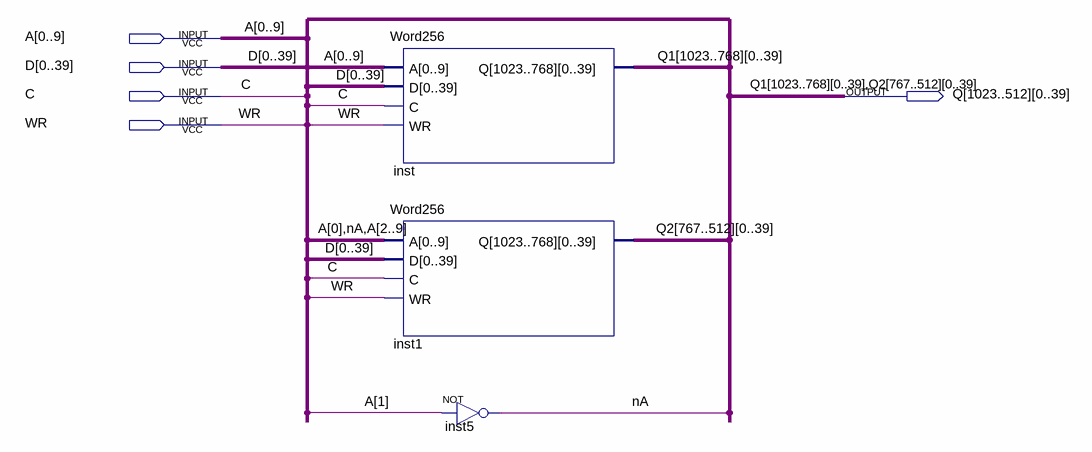
[diagram p0: schematic sheet]
// Quartus schematic Word512.bdf as structural Verilog: 3 symbols, 5 pins
module Word512 (
  input  [0:9] A,
  input  [0:39] D,
  input  C,
  input  WR,
  output [39:0] Q_1023,
  output [39:0] Q_1022,
  output [39:0] Q_1021,
  output [39:0] Q_1020,
  output [39:0] Q_1019,
  output [39:0] Q_1018,
  output [39:0] Q_1017,
  output [39:0] Q_1016,
  output [39:0] Q_1015,
  output [39:0] Q_1014,
  output [39:0] Q_1013,
  output [39:0] Q_1012,
  output [39:0] Q_1011,
  output [39:0] Q_1010,
  output [39:0] Q_1009,
  output [39:0] Q_1008,
  output [39:0] Q_1007,
  output [39:0] Q_1006,
  output [39:0] Q_1005,
  output [39:0] Q_1004,
  output [39:0] Q_1003,
  output [39:0] Q_1002,
  output [39:0] Q_1001,
  output [39:0] Q_1000,
  output [39:0] Q_999,
  output [39:0] Q_998,
  output [39:0] Q_997,
  output [39:0] Q_996,
  output [39:0] Q_995,
  output [39:0] Q_994,
  output [39:0] Q_993,
  output [39:0] Q_992,
  output [39:0] Q_991,
  output [39:0] Q_990,
  output [39:0] Q_989,
  output [39:0] Q_988,
  output [39:0] Q_987,
  output [39:0] Q_986,
  output [39:0] Q_985,
  output [39:0] Q_984,
  output [39:0] Q_983,
  output [39:0] Q_982,
  output [39:0] Q_981,
  output [39:0] Q_980,
  output [39:0] Q_979,
  output [39:0] Q_978,
  output [39:0] Q_977,
  output [39:0] Q_976,
  output [39:0] Q_975,
  output [39:0] Q_974,
  output [39:0] Q_973,
  output [39:0] Q_972,
  output [39:0] Q_971,
  output [39:0] Q_970,
  output [39:0] Q_969,
  output [39:0] Q_968,
  output [39:0] Q_967,
  output [39:0] Q_966,
  output [39:0] Q_965,
  output [39:0] Q_964,
  output [39:0] Q_963,
  output [39:0] Q_962,
  output [39:0] Q_961,
  output [39:0] Q_960,
  output [39:0] Q_959,
  output [39:0] Q_958,
  output [39:0] Q_957,
  output [39:0] Q_956,
  output [39:0] Q_955,
  output [39:0] Q_954,
  output [39:0] Q_953,
  output [39:0] Q_952,
  output [39:0] Q_951,
  output [39:0] Q_950,
  output [39:0] Q_949,
  output [39:0] Q_948,
  output [39:0] Q_947,
  output [39:0] Q_946,
  output [39:0] Q_945,
  output [39:0] Q_944,
  output [39:0] Q_943,
  output [39:0] Q_942,
  output [39:0] Q_941,
  output [39:0] Q_940,
  output [39:0] Q_939,
  output [39:0] Q_938,
  output [39:0] Q_937,
  output [39:0] Q_936,
  output [39:0] Q_935,
  output [39:0] Q_934,
  output [39:0] Q_933,
  output [39:0] Q_932,
  output [39:0] Q_931,
  output [39:0] Q_930,
  output [39:0] Q_929,
  output [39:0] Q_928,
  output [39:0] Q_927,
  output [39:0] Q_926,
  output [39:0] Q_925,
  output [39:0] Q_924,
  output [39:0] Q_923,
  output [39:0] Q_922,
  output [39:0] Q_921,
  output [39:0] Q_920,
  output [39:0] Q_919,
  output [39:0] Q_918,
  output [39:0] Q_917,
  output [39:0] Q_916,
  output [39:0] Q_915,
  output [39:0] Q_914,
  output [39:0] Q_913,
  output [39:0] Q_912,
  output [39:0] Q_911,
  output [39:0] Q_910,
  output [39:0] Q_909,
  output [39:0] Q_908,
  output [39:0] Q_907,
  output [39:0] Q_906,
  output [39:0] Q_905,
  output [39:0] Q_904,
  output [39:0] Q_903,
  output [39:0] Q_902,
  output [39:0] Q_901,
  output [39:0] Q_900,
  output [39:0] Q_899,
  output [39:0] Q_898,
  output [39:0] Q_897,
  output [39:0] Q_896,
  output [39:0] Q_895,
  output [39:0] Q_894,
  output [39:0] Q_893,
  output [39:0] Q_892,
  output [39:0] Q_891,
  output [39:0] Q_890,
  output [39:0] Q_889,
  output [39:0] Q_888,
  output [39:0] Q_887,
  output [39:0] Q_886,
  output [39:0] Q_885,
  output [39:0] Q_884,
  output [39:0] Q_883,
  output [39:0] Q_882,
  output [39:0] Q_881,
  output [39:0] Q_880,
  output [39:0] Q_879,
  output [39:0] Q_878,
  output [39:0] Q_877,
  output [39:0] Q_876,
  output [39:0] Q_875,
  output [39:0] Q_874,
  output [39:0] Q_873,
  output [39:0] Q_872,
  output [39:0] Q_871,
  output [39:0] Q_870,
  output [39:0] Q_869,
  output [39:0] Q_868,
  output [39:0] Q_867,
  output [39:0] Q_866,
  output [39:0] Q_865,
  output [39:0] Q_864,
  output [39:0] Q_863,
  output [39:0] Q_862,
  output [39:0] Q_861,
  output [39:0] Q_860,
  output [39:0] Q_859,
  output [39:0] Q_858,
  output [39:0] Q_857,
  output [39:0] Q_856,
  output [39:0] Q_855,
  output [39:0] Q_854,
  output [39:0] Q_853,
  output [39:0] Q_852,
  output [39:0] Q_851,
  output [39:0] Q_850,
  output [39:0] Q_849,
  output [39:0] Q_848,
  output [39:0] Q_847,
  output [39:0] Q_846,
  output [39:0] Q_845,
  output [39:0] Q_844,
  output [39:0] Q_843,
  output [39:0] Q_842,
  output [39:0] Q_841,
  output [39:0] Q_840,
  output [39:0] Q_839,
  output [39:0] Q_838,
  output [39:0] Q_837,
  output [39:0] Q_836,
  output [39:0] Q_835,
  output [39:0] Q_834,
  output [39:0] Q_833,
  output [39:0] Q_832,
  output [39:0] Q_831,
  output [39:0] Q_830,
  output [39:0] Q_829,
  output [39:0] Q_828,
  output [39:0] Q_827,
  output [39:0] Q_826,
  output [39:0] Q_825,
  output [39:0] Q_824,
  output [39:0] Q_823,
  output [39:0] Q_822,
  output [39:0] Q_821,
  output [39:0] Q_820,
  output [39:0] Q_819,
  output [39:0] Q_818,
  output [39:0] Q_817,
  output [39:0] Q_816,
  output [39:0] Q_815,
  output [39:0] Q_814,
  output [39:0] Q_813,
  output [39:0] Q_812,
  output [39:0] Q_811,
  output [39:0] Q_810,
  output [39:0] Q_809,
  output [39:0] Q_808,
  output [39:0] Q_807,
  output [39:0] Q_806,
  output [39:0] Q_805,
  output [39:0] Q_804,
  output [39:0] Q_803,
  output [39:0] Q_802,
  output [39:0] Q_801,
  output [39:0] Q_800,
  output [39:0] Q_799,
  output [39:0] Q_798,
  output [39:0] Q_797,
  output [39:0] Q_796,
  output [39:0] Q_795,
  output [39:0] Q_794,
  output [39:0] Q_793,
  output [39:0] Q_792,
  output [39:0] Q_791,
  output [39:0] Q_790,
  output [39:0] Q_789,
  output [39:0] Q_788,
  output [39:0] Q_787,
  output [39:0] Q_786,
  output [39:0] Q_785,
  output [39:0] Q_784,
  output [39:0] Q_783,
  output [39:0] Q_782,
  output [39:0] Q_781,
  output [39:0] Q_780,
  output [39:0] Q_779,
  output [39:0] Q_778,
  output [39:0] Q_777,
  output [39:0] Q_776,
  output [39:0] Q_775,
  output [39:0] Q_774,
  output [39:0] Q_773,
  output [39:0] Q_772,
  output [39:0] Q_771,
  output [39:0] Q_770,
  output [39:0] Q_769,
  output [39:0] Q_768,
  output [39:0] Q_767,
  output [39:0] Q_766,
  output [39:0] Q_765,
  output [39:0] Q_764,
  output [39:0] Q_763,
  output [39:0] Q_762,
  output [39:0] Q_761,
  output [39:0] Q_760,
  output [39:0] Q_759,
  output [39:0] Q_758,
  output [39:0] Q_757,
  output [39:0] Q_756,
  output [39:0] Q_755,
  output [39:0] Q_754,
  output [39:0] Q_753,
  output [39:0] Q_752,
  output [39:0] Q_751,
  output [39:0] Q_750,
  output [39:0] Q_749,
  output [39:0] Q_748,
  output [39:0] Q_747,
  output [39:0] Q_746,
  output [39:0] Q_745,
  output [39:0] Q_744,
  output [39:0] Q_743,
  output [39:0] Q_742,
  output [39:0] Q_741,
  output [39:0] Q_740,
  output [39:0] Q_739,
  output [39:0] Q_738,
  output [39:0] Q_737,
  output [39:0] Q_736,
  output [39:0] Q_735,
  output [39:0] Q_734,
  output [39:0] Q_733,
  output [39:0] Q_732,
  output [39:0] Q_731,
  output [39:0] Q_730,
  output [39:0] Q_729,
  output [39:0] Q_728,
  output [39:0] Q_727,
  output [39:0] Q_726,
  output [39:0] Q_725,
  output [39:0] Q_724,
  output [39:0] Q_723,
  output [39:0] Q_722,
  output [39:0] Q_721,
  output [39:0] Q_720,
  output [39:0] Q_719,
  output [39:0] Q_718,
  output [39:0] Q_717,
  output [39:0] Q_716,
  output [39:0] Q_715,
  output [39:0] Q_714,
  output [39:0] Q_713,
  output [39:0] Q_712,
  output [39:0] Q_711,
  output [39:0] Q_710,
  output [39:0] Q_709,
  output [39:0] Q_708,
  output [39:0] Q_707,
  output [39:0] Q_706,
  output [39:0] Q_705,
  output [39:0] Q_704,
  output [39:0] Q_703,
  output [39:0] Q_702,
  output [39:0] Q_701,
  output [39:0] Q_700,
  output [39:0] Q_699,
  output [39:0] Q_698,
  output [39:0] Q_697,
  output [39:0] Q_696,
  output [39:0] Q_695,
  output [39:0] Q_694,
  output [39:0] Q_693,
  output [39:0] Q_692,
  output [39:0] Q_691,
  output [39:0] Q_690,
  output [39:0] Q_689,
  output [39:0] Q_688,
  output [39:0] Q_687,
  output [39:0] Q_686,
  output [39:0] Q_685,
  output [39:0] Q_684,
  output [39:0] Q_683,
  output [39:0] Q_682,
  output [39:0] Q_681,
  output [39:0] Q_680,
  output [39:0] Q_679,
  output [39:0] Q_678,
  output [39:0] Q_677,
  output [39:0] Q_676,
  output [39:0] Q_675,
  output [39:0] Q_674,
  output [39:0] Q_673,
  output [39:0] Q_672,
  output [39:0] Q_671,
  output [39:0] Q_670,
  output [39:0] Q_669,
  output [39:0] Q_668,
  output [39:0] Q_667,
  output [39:0] Q_666,
  output [39:0] Q_665,
  output [39:0] Q_664,
  output [39:0] Q_663,
  output [39:0] Q_662,
  output [39:0] Q_661,
  output [39:0] Q_660,
  output [39:0] Q_659,
  output [39:0] Q_658,
  output [39:0] Q_657,
  output [39:0] Q_656,
  output [39:0] Q_655,
  output [39:0] Q_654,
  output [39:0] Q_653,
  output [39:0] Q_652,
  output [39:0] Q_651,
  output [39:0] Q_650,
  output [39:0] Q_649,
  output [39:0] Q_648,
  output [39:0] Q_647,
  output [39:0] Q_646,
  output [39:0] Q_645,
  output [39:0] Q_644,
  output [39:0] Q_643,
  output [39:0] Q_642,
  output [39:0] Q_641,
  output [39:0] Q_640,
  output [39:0] Q_639,
  output [39:0] Q_638,
  output [39:0] Q_637,
  output [39:0] Q_636,
  output [39:0] Q_635,
  output [39:0] Q_634,
  output [39:0] Q_633,
  output [39:0] Q_632,
  output [39:0] Q_631,
  output [39:0] Q_630,
  output [39:0] Q_629,
  output [39:0] Q_628,
  output [39:0] Q_627,
  output [39:0] Q_626,
  output [39:0] Q_625,
  output [39:0] Q_624,
  output [39:0] Q_623,
  output [39:0] Q_622,
  output [39:0] Q_621,
  output [39:0] Q_620,
  output [39:0] Q_619,
  output [39:0] Q_618,
  output [39:0] Q_617,
  output [39:0] Q_616,
  output [39:0] Q_615,
  output [39:0] Q_614,
  output [39:0] Q_613,
  output [39:0] Q_612,
  output [39:0] Q_611,
  output [39:0] Q_610,
  output [39:0] Q_609,
  output [39:0] Q_608,
  output [39:0] Q_607,
  output [39:0] Q_606,
  output [39:0] Q_605,
  output [39:0] Q_604,
  output [39:0] Q_603,
  output [39:0] Q_602,
  output [39:0] Q_601,
  output [39:0] Q_600,
  output [39:0] Q_599,
  output [39:0] Q_598,
  output [39:0] Q_597,
  output [39:0] Q_596,
  output [39:0] Q_595,
  output [39:0] Q_594,
  output [39:0] Q_593,
  output [39:0] Q_592,
  output [39:0] Q_591,
  output [39:0] Q_590,
  output [39:0] Q_589,
  output [39:0] Q_588,
  output [39:0] Q_587,
  output [39:0] Q_586,
  output [39:0] Q_585,
  output [39:0] Q_584,
  output [39:0] Q_583,
  output [39:0] Q_582,
  output [39:0] Q_581,
  output [39:0] Q_580,
  output [39:0] Q_579,
  output [39:0] Q_578,
  output [39:0] Q_577,
  output [39:0] Q_576,
  output [39:0] Q_575,
  output [39:0] Q_574,
  output [39:0] Q_573,
  output [39:0] Q_572,
  output [39:0] Q_571,
  output [39:0] Q_570,
  output [39:0] Q_569,
  output [39:0] Q_568,
  output [39:0] Q_567,
  output [39:0] Q_566,
  output [39:0] Q_565,
  output [39:0] Q_564,
  output [39:0] Q_563,
  output [39:0] Q_562,
  output [39:0] Q_561,
  output [39:0] Q_560,
  output [39:0] Q_559,
  output [39:0] Q_558,
  output [39:0] Q_557,
  output [39:0] Q_556,
  output [39:0] Q_555,
  output [39:0] Q_554,
  output [39:0] Q_553,
  output [39:0] Q_552,
  output [39:0] Q_551,
  output [39:0] Q_550,
  output [39:0] Q_549,
  output [39:0] Q_548,
  output [39:0] Q_547,
  output [39:0] Q_546,
  output [39:0] Q_545,
  output [39:0] Q_544,
  output [39:0] Q_543,
  output [39:0] Q_542,
  output [39:0] Q_541,
  output [39:0] Q_540,
  output [39:0] Q_539,
  output [39:0] Q_538,
  output [39:0] Q_537,
  output [39:0] Q_536,
  output [39:0] Q_535,
  output [39:0] Q_534,
  output [39:0] Q_533,
  output [39:0] Q_532,
  output [39:0] Q_531,
  output [39:0] Q_530,
  output [39:0] Q_529,
  output [39:0] Q_528,
  output [39:0] Q_527,
  output [39:0] Q_526,
  output [39:0] Q_525,
  output [39:0] Q_524,
  output [39:0] Q_523,
  output [39:0] Q_522,
  output [39:0] Q_521,
  output [39:0] Q_520,
  output [39:0] Q_519,
  output [39:0] Q_518,
  output [39:0] Q_517,
  output [39:0] Q_516,
  output [39:0] Q_515,
  output [39:0] Q_514,
  output [39:0] Q_513,
  output [39:0] Q_512
);

  wire nA;
